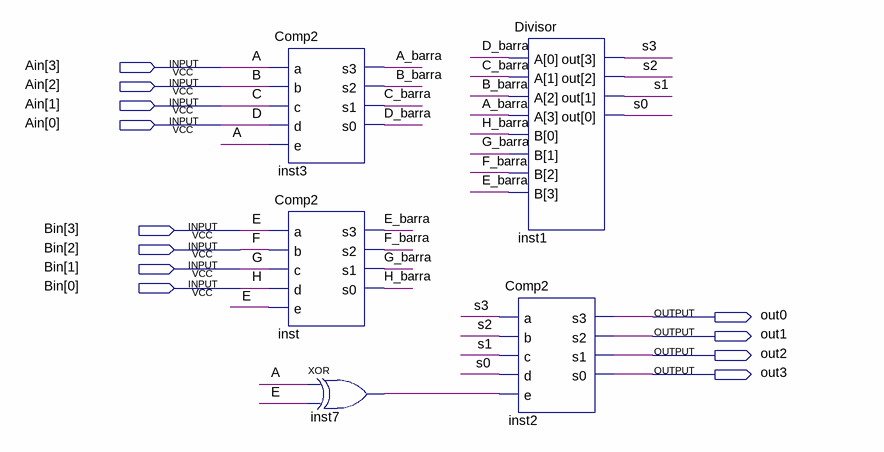
[diagram p0: schematic sheet]
// Quartus schematic Divisorcomsinal.bdf as structural Verilog: 5 symbols, 12 pins
module Divisorcomsinal (
  input  [3:0] Ain,
  input  [3:0] Bin,
  output out0,
  output out1,
  output out2,
  output out3
);

  wire A_barra, B_barra, C_barra, D_barra, E_barra, F_barra, G_barra, H_barra, inst7_out, s0, s1, s2, s3;

  Comp2 inst3 (
    .a(Ain[3]), .b(Ain[2]), .c(Ain[1]), .d(Ain[0]), .e(Ain[3]), .s3(A_barra), .s2(B_barra), .s1(C_barra),
    .s0(D_barra));
  Comp2 inst (
    .a(Bin[3]), .b(Bin[2]), .c(Bin[1]), .d(Bin[0]), .e(Bin[3]), .s3(E_barra), .s2(F_barra), .s1(G_barra),
    .s0(H_barra));
  xor inst7 (inst7_out, Ain[3], Bin[3]);
  Divisor inst1 (
    .A({A_barra, B_barra, C_barra, D_barra}), .B({E_barra, F_barra, G_barra, H_barra}), .out({s3, s2, s1, s0}));
  Comp2 inst2 (.a(s3), .b(s2), .c(s1), .d(s0), .e(inst7_out), .s3(out0), .s2(out1), .s1(out2), .s0(out3));

  // Other names for the same wires on the sheet: A = Ain[3]; B = Ain[2]; C = Ain[1]; D = Ain[0]; E = Bin[3];
  //   F = Bin[2]; G = Bin[1]; H = Bin[0]
endmodule
